# EAGLE design ct.brick.ctmodel2 (EAGLE 5.11)
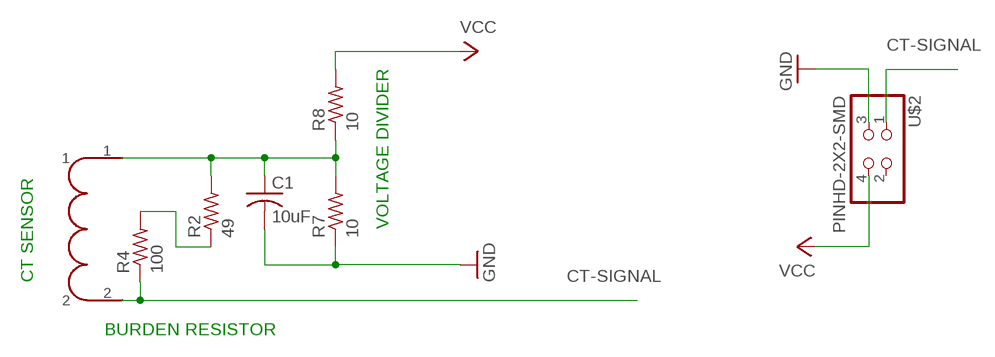
[diagram p0: schematic, sheet 1]

## Parts
C1  10uF  C-USC1206  [C1206]
R2  49  R-US_R1206  [R1206]
R4  100  R-US_R1206  [R1206]
R7  10  R-US_R1206  [R1206]
R8  10  R-US_R1206  [R1206]
U$1  PE-5168  [PE-5168]
U$2  PINHD-2X2-SMD  [2X02SMD]

## Nets
CT-SIGNAL: R4.1 U$1.2 U$2.1
GND: C1.2 R7.1 U$2.3
N$1: R2.1 R4.2
N$2: C1.1 R2.2 R7.2 R8.1 U$1.1
VCC: R8.2 U$2.4
Unconnected: U$2.2

## Notes on the sheet
- VOLTAGE DIVIDER
- CT SENSOR
- BURDEN RESISTOR

## Library data of the parts
C1 = resistor:C-US: CAPACITOR, American symbol
R2 R4 R7 R8 = resistor:R-US_: RESISTOR, American symbol
U$1 = fab:PE-5168: Ct sensor
U$2 = fab:PINHD-2X2-SMD

## Net classes
0 default: width 0.356 mm

## Board
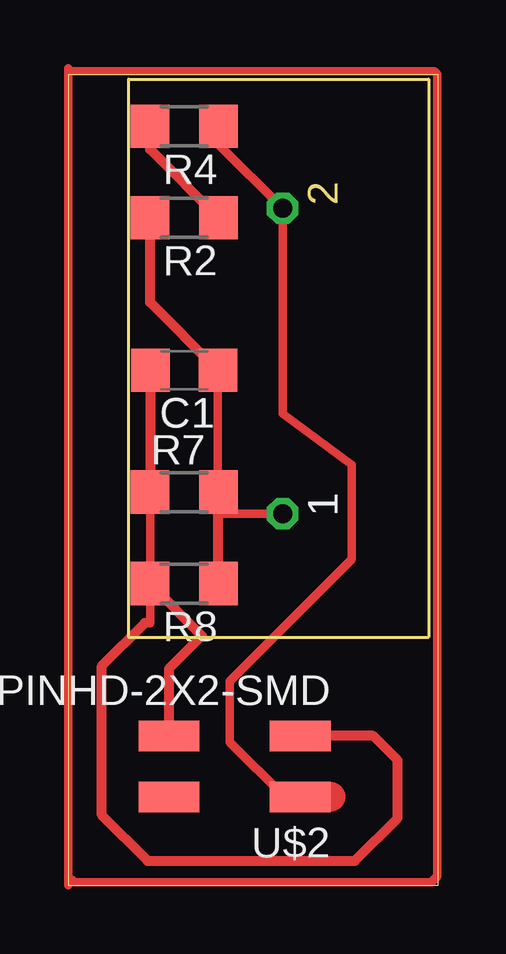
[diagram p1: board, top side]

Size 15.42 x 33.77 mm. Coordinates in mm from the lower left corner, seen from the top.
Outline: 0,0 15.42,0 15.42,33.77 0,33.77 0,0
Copper layers (1*16): Top 0.035mm / dielectric 1.5mm / Bottom 0.035mm
Design rules "default": minimum track width 10mil, minimum drill 24mil, track to track 8mil, track to pad 8mil, pad to pad 8mil, via to via 8mil, smd to smd 8mil, copper to edge 40mil, drill to drill 8mil, minimum pad ring 10mil, minimum via ring 8mil, stop-mask expansion 4mil, vias tented up to drill 0mil, thermal gap 10mil

### Footprints (pad centres in the part's own frame; a part is rotated, then mirrored left to right if it is on the bottom)
C1206 = smd 1.6 x 1.8: 1 -1.4,0; 2 1.4,0
R1206 = smd 1.6 x 1.803: 1 -1.422,0; 2 1.422,0
PE-5168 = drill 0.8 octagon: 1 -6.365,-0.035; 2 6.365,-0.035
2X02SMD = smd 2.54 x 1.27: 1 -2.54,1.27; 2 2.92,1.27; 3 -2.54,-1.27; 4 2.92,-1.27

### Placement (x,y rotation side)
C1  4.83,21.46 180 top
R2  4.83,27.81 180 top
R4  4.83,31.62 180 top
R7  4.83,16.38 0 top
R8  4.83,12.57 180 top
U$1  8.89,21.84 90 top
U$2  7.11,4.95 180 top

### Tracks (layer width: path | path; a pad name or v marks a point on that pad's centre or on a via)
CT-SIGNAL
  Top 0.35: R4.1 6.25,30.89 U$1.2 8.93,19.65 11.81,17.53 11.81,13.59 6.73,8.51 6.73,5.97 9.02,3.68 U$2.1
GND
  Top 0.35: 3.17,10.92 3.4,10.92 R7.1
  Top 0.406: 3.43,16.41 C1.2 | R7.1 3.43,16.41 | 3.43,16.41 2.82,16.41 | 3.17,10.92 1.4,9.14 1.4,2.92 3.3,1.02 11.94,1.02 13.72,2.79 13.72,5.21 12.7,6.22 10.16,6.22 10.29,6.1 9.78,6.1 U$2.3
N$1
  Top 0.406: R4.2 3.4,30.66 R2.1
N$2
  Top 0.35: U$1.1 6.25,15.48 R7.2 6.23,16.38 C1.1
  Top 0.406: R2.2 3.4,24.29 C1.1 | R8.1 R7.2
N$3
  Top 0.35: 0,0 0,34.04
N$4
  Top 0.35: 0.13,33.91 15.24,33.91 15.37,33.78 15.37,0.38 15.11,0.13 0.25,0.13 0.13,0.25
VCC
  Top 0.406: R8.2 5.56,10.39 4.19,9.02 U$2.4
(copper drawn outside any net)
  shapes: Top circle x2